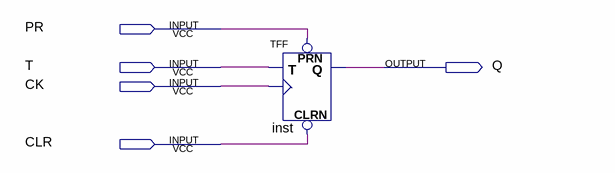
[diagram p0: schematic sheet]
// Quartus schematic T_FF.bdf as structural Verilog: 1 symbols, 5 pins
module T_FF (
  input  PR,
  input  T,
  input  CK,
  input  CLR,
  output Q
);

  TFF inst (.PRN(PR), .CLRN(CLR), .T(T), .CLK(CK), .Q(Q));
endmodule
